# Altium schematic sheet watch.SchDoc
size A3
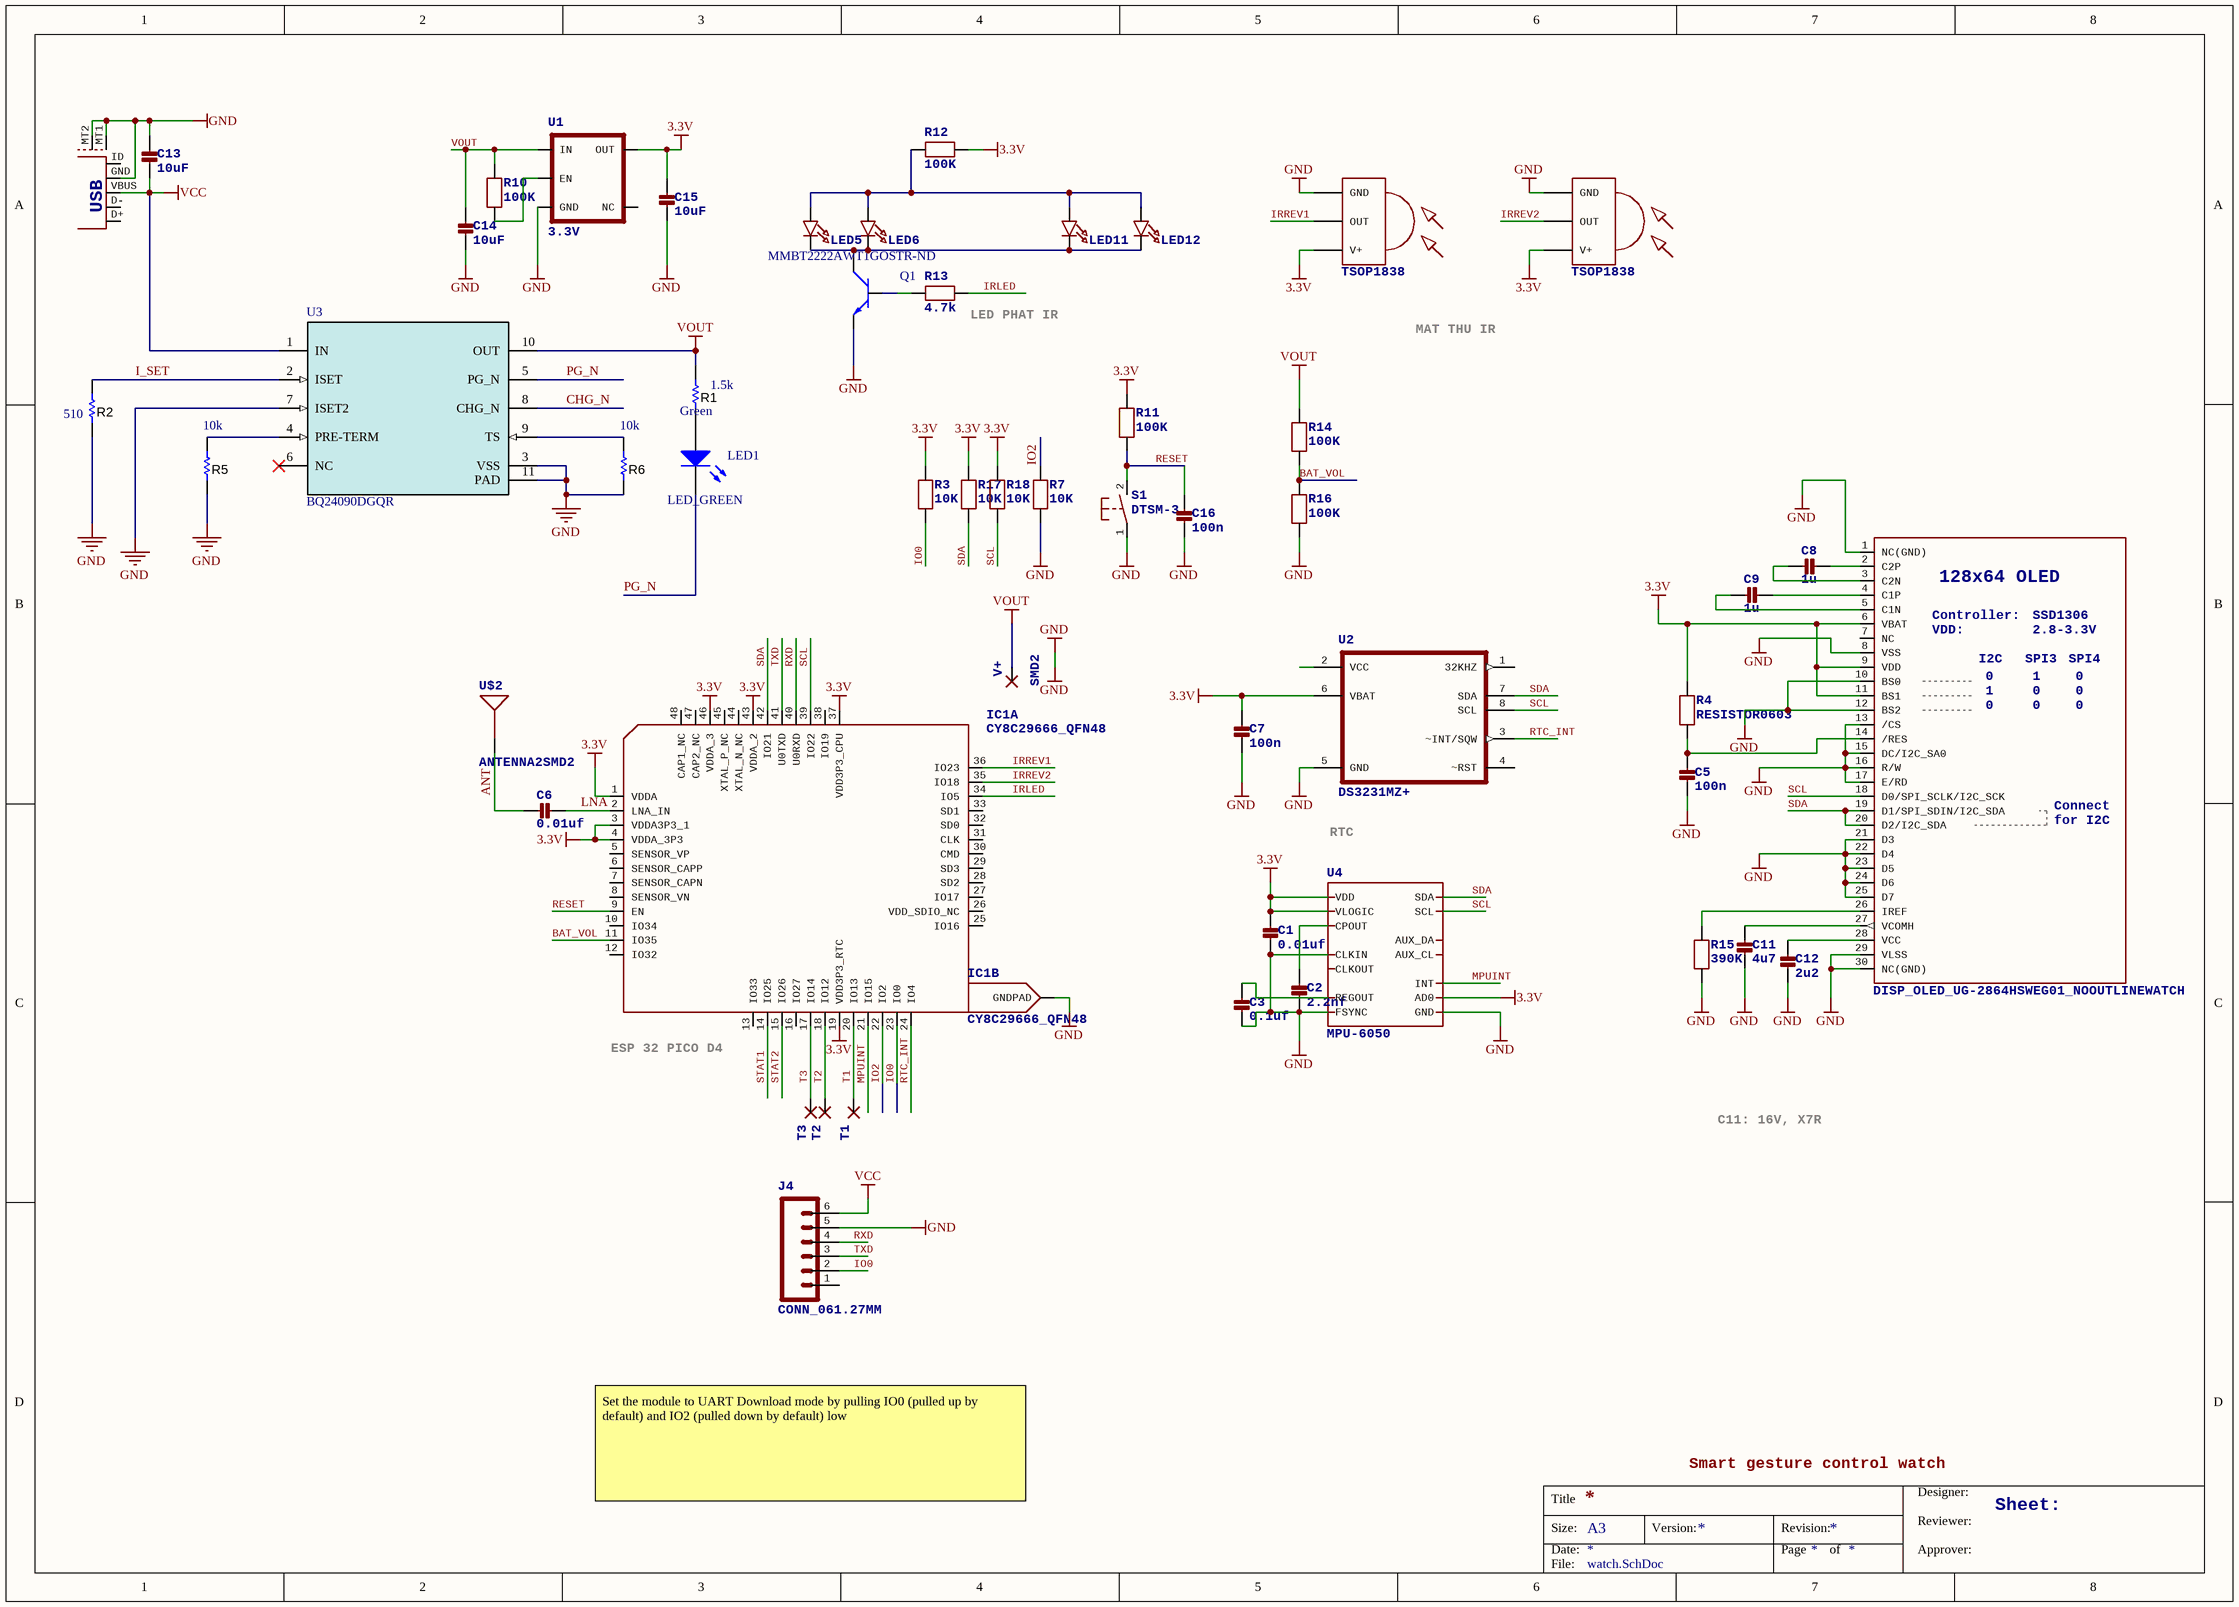
[diagram p0: watch.SchDoc]

## Parts
C1  0.01uf  [0603]
C2  2.2nf  [0603]
C3  0.1uf  [0603]
C5  100n  [0603]
C6  0.01uf  [0603]
C7  100n  [0603]
C8  1u  [0603]
C9  1u  [0603]
C11  4u7  [0603]
C12  2u2  [0603]
C13  10uF  [0603]
C14  10uF  [0603]
C15  10uF  [0603]
C16  100n  [0603]
IC1  CY8C29666_QFN48  [QFN48]  (parts A,B of 2)
J4  CONN_061.27MM  [1X06_1.27MM]
LED1  LED_GREEN  Color: Green  [led0603]
LED5  LED0805  [CHIPLED_0805]  (value not drawn)
LED6  LED0805  [CHIPLED_0805]  (value not drawn)
LED11  LED0805  [CHIPLED_0805]  (value not drawn)
LED12  LED0805  [CHIPLED_0805]  (value not drawn)
OLED1  DISP_OLED_UG-2864HSWEG01_NOOUTLINEWATCH  128x64OLED: 128x64 OLED  forI2C: for I2C  Controller: Controller:  VDD: VDD:  [UG-2864HSWEG01_1.3_WRAPAROUND_WATCH]
Q1  Supplier Part Number 1: MMBT2222AWT1GOSTR-ND  [SOT-323]  (hidden comment: MMBT2222A)
R1  Resistance (Ohms): 1.5k  [0603]
R2  Resistance (Ohms): 510  [0603]
R3  10K  [0603]
R4  RESISTOR0603  [0603]
R5  Resistance (Ohms): 10k  [0603]
R6  Resistance (Ohms): 10k  [0603]
R7  10K  [0603]
R10  100K  [0603]
R11  100K  [0603]
R12  100K  [0603]
R13  4.7k  [0603]
R14  100K  [0603]
R15  390K  [0603]
R16  100K  [0603]
R17  10K  [0603]
R18  10K  [0603]
S1  DTSM-3  [DTSM-3]
T1  SMD2  [SMD1,27-2,54]  (value not drawn)
T2  SMD2  [SMD1,27-2,54]  (value not drawn)
T3  SMD2  [SMD1,27-2,54]  (value not drawn)
U1  3.3V  [SOT23-5]
U2  DS3231MZ+  [SOIC8_150MIL_SMPAD]
U3  BQ24090DGQR  [DGQ0010D_NV_N]
U4  MPU-6050  [QFN.24.4X4]
U$2  ANTENNA2SMD2  [ANTENNA-CHIP3]
U$3  TSOP1838  [TSOP18XX]
U$4  TSOP1838  [TSOP18XX]
USB1  USB-MICROBLARGEPAD  [USB-MICROB_LARGEPAD]  (value not drawn)
V+  SMD2  [SMD1,27-2,54]

## Nets
3.3V: C1.2(P$2) C7.1(P$1) C15.1(P$1) IC1.1(VDDA) IC1.3(VDDA3P3_1) IC1.4(VDDA_3P3) IC1.19(VDD3P3_RTC) IC1.37(VDD3P3_CPU) IC1.43(VDDA_2) IC1.46(VDDA_3) OLED1.6(VBAT) OLED1.9(VDD) OLED1.11(BS1) R3.1 R4.2 R11.2 R12.1 R17.1 R18.1 U1.5(OUT) U2.6(VBAT) U4.8(VLOGIC) U4.9(AD0) U4.13(VDD) U$3.VCC(V+) U$4.VCC(V+)
GND: C1.1(P$1) C2.2(P$2) C3.1(P$1) C5.2(P$2) C7.2(P$2) C11.2(P$2) C12.2(P$2) C13.1(P$1) C14.2(P$2) C15.2(P$2) C16.2(P$2) IC1.EXP(GNDPAD) J4.5 OLED1.1(NC(GND)) OLED1.8(VSS) OLED1.10(BS0) OLED1.12(BS2) OLED1.13(/CS) OLED1.15(DC/I2C_SA0) OLED1.16(R/W) OLED1.17(E/RD) OLED1.21(D3) OLED1.22(D4) OLED1.23(D5) OLED1.24(D6) OLED1.25(D7) OLED1.29(VLSS) OLED1.30(NC(GND)) Q1.2(E) R2.1 R5.1 R6.1 R7.2 R15.1 R16.2 S1.1 U1.2(GND) U2.5(GND) U3.3(VSS) U3.7(ISET2) U3.11(PAD) U4.1(CLKIN) U4.11(FSYNC) U4.18(GND) U$3.GND U$4.GND USB1.GND USB1.MT1(SHEILD1) USB1.MT2(SHEILD2)
VCC: C13.2(P$2) J4.6 U3.1(IN) USB1.VBUS
VOUT: C14.1(P$1) R1.2 R10.2 R14.1 U1.1(IN) U3.10(OUT) V+.1(P)
ANT: C6.1(P$1) U$2.FEED(SIGNAL)
BAT_VOL: IC1.11(IO35) R14.2 R16.1
CHG_N: U3.8(CHG_N)
I_SET: R2.2 U3.2(ISET)
IO0: IC1.23(IO0) J4.2 R3.2
IO2: IC1.22(IO2) R7.1
IRLED: IC1.34(IO5) R13.1
IRREV1: IC1.36(IO23) U$4.OUT
IRREV2: IC1.35(IO18) U$3.OUT
LNA: C6.2(P$2) IC1.2(LNA_IN)
MPUINT: IC1.21(IO15) U4.12(INT)
PG_N: LED1.2(K) U3.5(PG_N)
RESET: C16.1(P$1) IC1.9(EN) R11.1 S1.2
RTC_INT: IC1.24(IO4) U2.3(~INT/SQW)
RXD: IC1.40(U0RXD) J4.4
SCL: IC1.39(IO22) OLED1.18(D0/SPI_SCLK/I2C_SCK) R18.2 U2.8(SCL) U4.23(SCL)
SDA: IC1.42(IO21) OLED1.19(D1/SPI_SDIN/I2C_SDA) OLED1.20(D2/I2C_SDA) R17.2 U2.7(SDA) U4.24(SDA)
STAT1: IC1.14(IO25)
STAT2: IC1.15(IO26)
T1: IC1.20(IO13) T1.1(P)
T2: IC1.18(IO12) T2.1(P)
T3: IC1.17(IO14) T3.1(P)
TXD: IC1.41(U0TXD) J4.3
NetC2_1: C2.1(P$1) U4.20(CPOUT)
NetC3_2: C3.2(P$2) U4.10(REGOUT)
NetC5_1: C5.1(P$1) OLED1.14(/RES) R4.1
NetC8_1: C8.1(P$1) OLED1.3(C2N)
NetC8_2: C8.2(P$2) OLED1.2(C2P)
NetC9_1: C9.1(P$1) OLED1.5(C1N)
NetC9_2: C9.2(P$2) OLED1.4(C1P)
NetC11_1: C11.1(P$1) OLED1.27(VCOMH)
NetC12_1: C12.1(P$1) OLED1.28(VCC)
NetLED1_1: LED1.1(A) R1.1
NetLED5_1: LED5.1(A) LED6.1(A) LED11.1(A) LED12.1(A) R12.2
NetLED5_2: LED5.2(C) LED6.2(C) LED11.2(C) LED12.2(C) Q1.3(C)
NetOLED1_26: OLED1.26(IREF) R15.2
NetQ1_1: Q1.1(B) R13.2
NetR5_2: R5.2 U3.4(PRE-TERM)
NetR6_2: R6.2 U3.9(TS)
NetR10_1: R10.1 U1.3(EN)

Not connected (* = marked no-connect by the designer): IC1 5(SENSOR_VP) 6(SENSOR_CAPP) 7(SENSOR_CAPN) 8(SENSOR_VN) 10(IO34) 12(IO32) 13(IO33) 16(IO27) 25(IO16) 26(VDD_SDIO_NC) 27(IO17) 28(SD2) 29(SD3) 30(CMD) 31(CLK) 32(SD0) 33(SD1) 38(IO19) 44(XTAL_N_NC) 45(XTAL_P_NC) 47(CAP2_NC) 48(CAP1_NC); J4 1; OLED1 7(NC); U1 4(NC); U2 1(32KHZ) 2(VCC) 4(~RST); U3 6(NC)*; U4 6(AUX_DA) 7(AUX_CL) 22(CLKOUT); USB1 D+ D- ID

## Notes on the sheet
- (near R13) LED PHAT IR
- MAT THU IR
- RTC
- (near IC1) ESP 32 PICO D4
- C11: 16V, X7R
- Smart gesture control watch
- Set the module to UART Download mode by pulling IO0 (pulled up by default) and IO2 (pulled down by default) low
- Sheet:
- Title
- Size:
- Date:
- A3
- Version:
- Revision:
- Page
- of
- Designer:
- Reviewer:
- Approver:
- File:

## Library data of the parts
C1-C3 C5-C9 C11-C16 = CAP_CERAMIC0603: Ceramic Capacitors0402 - 0402 Surface Mount Capacitors  16pF 50V 5% [Digikey: 445-4899-2-ND]  18pF 50V 5% [Digikey: 490-1281-2-ND]  22pF 50V 5% [Digikey: 490-1283-2-ND]  68pF 50V 5% [Digikey: 490-1289-2-ND]  0.1uF 10V 10% [Digikey: 490-1318-2-ND]  1.0uF 6.3V 10% [Digikey: 490-1320-2-ND]    0603 - 0603 Surface Mount Capacitors  16 pF 50V 5% [Digikey: 445-5051-2-ND]  22 pF 50V [Digikey: PCC220ACVTR-ND]  33 pF 50V 5% [Digikey: 490-1415-1-ND]  56pF 50V 5% [Digikey: 490-1421-1-ND]  220pF 50V 5% [Digikey: 445-1285-1-ND]  680 pF 50V   2200 pF 50V 5% C0G [Digikey: 445-1297-1-ND]  5600 pF 100V 5% X7R [Digikey: 478-3711-1-ND]  0.1 µF 25V 10% [Digikey: PCC2277TR-ND]  0.22 µF 16V 10% X7R [Digikey: 445-1318-1-ND]  1.0 µF 25V 10% [Digikey: 445-5146-2-ND]    0603 - RF Specific  3pF 250V +/-0.1pF RF [Digikey: 712-1347-1-ND]  18 pF 250V 5%  [Digikey: 478-3505-1-ND or 712-1322-1-ND]  56 pF 250V 5% C0G RF [Digikey: 490-4867-1-ND]  68 pF 250V RF [Digikey: 490-4868-1-ND]    0805 - 0805 Surface Mount Capacitors  220 pF 250V 2% RF Ceramic Capacitor [Digikey: 712-1398-1-ND]  1000 pF 50V 2% NP0 Ceramic Capacitor [Digikey: 478-3760-1-ND]  0.1 µF 25V 10% Ceramic Capacitor [Digikey: PCC1828TR-ND]  1.0 µF 16V 10% Ceramic Capacitor[Digikey: 490-1691-2-ND]  10.0 µF 10V 10% Ceramic Capacitor[Digikey: 709-1228-1-ND]  10.0 uF 16V 10% Ceramic Capacitor [Digikey: 478-5165-2-ND]  47 uF 6.3V 20% Ceramic Capacitor [Digikey: 587-1779-1-ND or 399-5506-1-ND]       1206 - 1206 Surface Mount Capacitors  47uF 10V 20% Ceramic Capacitor [Digikey: 490-5528-1-ND or 399-5508-1-ND or 445-6010-1-ND]  100uF 6.3V -20%, +80% Y5V Ceramic Capacitor (Digikey: 490-4512-1-ND, Mouser: 81-GRM31CF50J107ZE1L)
J4 = CONN_061.27MM: Multi connection point. Often used as Generic Header-pin footprint for 0.1 inch spaced/style header connections    On any of the 0.1 inch spaced packages, you can populate with these:  Break Away Headers - Straight (PRT-00116)   Break Away Male Headers - Right Angle (PRT-00553)   Female Headers (PRT-00115)   Break Away Headers - Machine Pin (PRT-00117)   Break Away Female Headers - Swiss Machine Pin (PRT-00743)   Arduino Stackable Header - 6 Pin (PRT-09280)        For SCREWTERMINALS and SPRING TERMINALS visit here:  Screw Terimnals on SparkFun.com (5mm/3.5mm/2.54mm spacing)       This device is also useful as a general connection point to wire up your design to another part of your project. Our various solder wires solder well into these plated through hole pads.  Hook-Up Wire - Assortment (Stranded, 22 AWG) (PRT-11375)   Hook-Up Wire - Assortment (Solid Core, 22 AWG) (PRT-11367)   View the entire wire category on our website here
LED1 = LED_GREEN: Typical INFRARED GaAs LED; Manufacturer: Lite-On Inc.; Manufacturer Part Number: LTST-C191KGKT; Lens Color: Colorless; Lens Transparency: Clear; Millicandela Rating: 35mcd; Lens Style/Size: Rectangle with Flat Top, 1.10mm x 0.80mm; Voltage - Forward (Vf) (Typ): 2V; Current - Test: 20mA; Viewing Angle: 130°; Wavelength - Dominant: 571nm; Wavelength - Peak: 574nm; Supplier 1: Digi-Key; RoHS: RoHS Compliant; Category: Optoelectronics; Stock 1: 780000; Pricing 1: 5000=0.0404, 10000=0.03636, 25000=0.03232, 50000=0.02929, 125000=0.02727 (USD); Packaging: Tape & Reel (TR); Part Status: Active; Mounting Type: Surface Mount; Features: -; Package / Case: 0603 (1608 Metric); Supplier Device Package: *; Size / Dimension: 1.60mm L x 0.80mm W; Height (Max): 0.55mm; ComponentLink1URL: http://optoelectronics.liteon.com/upload/download/DS22-2000-228/S_110_LTST-C191KGKT.pdf; ComponentLink1Description: http://optoelectronics.liteon.com/upload/download/DS22-2000-228/S_110_LTST-C191KGKT.pdf; Supplier Part Number 1: 160-1446-2-ND
LED5 LED6 LED11 LED12 = LED0805: LED0603 - 0603 Surface Mount Package    2mA: Green LED - Low Power (3.9mcd, 2ma, 1.7Vf) - Digikey: 475-2709-2-ND  Orange LED - Low Power (9.8mcd, 2ma, 1.8Vf) - Digikey: 475-1194-2-ND  Red LED - Low Power (5mcd, 2ma, 1.8Vf) - Digikey: 475-1195-2-ND  Yellow LED - Low Power (7mcd, 2ma, 1.8Vf) - Digikey: 475-1196-2-ND       5mA: Blue LED - Low Power (17mcd, 5ma, 2.9Vf) - Digikey: LNJ937W8CRACT-ND    0805 - 0805 Surface Mount Package    2mA: Red LED (8.8mcd, 2mA, 1.8Vf, Clear) - Low Power [Digikey: 475-2510-1-ND]  Green LED (5mcd, 2mA, 1.8Vf, Clear) - Low Power [Digikey: 475-2730-1-ND]  Yellow LED (11.3mcd, 2mA, 1.8Vf, Clear) - Low Power [Digikey: 475-2555-1-ND]       20mA: Red LED (104mcd, 20mA, Diffused) - LS R976 [Digikey: 475-1278-6-ND]  Red LED (12mcd, 20mA, 2.0Vf, Clear) - APT2012EC [Digikey: 754-1128-1-ND]  Green LED (15mcd, 20mA, 2.2Vf, Clear) - APT2012GC [Digikey: 754-1131-1-ND]  Orange LED (160mcd, 20mA, 2.1Vf, Clear) - APT2012SECK [Digikey: 754-1130-1-ND]     1206 - 1206 Surface Mount Package  Green LED (26mcd, 20mA, Diffused) - LG N971  [Digikey: 475-1407-6-ND]  Red LED (15mcd, 20mA, Diffused) - LH N974 [Digikey: 475-1416-6-ND]
Q1 = MMBT2222A: NPN switching transistor  40V 600mA SOT23; Manufacturer: ON Semiconductor; Manufacturer Part Number: MMBT2222AWT1G; Vce Saturation (Max) @ Ib, Ic: 1V @ 50mA, 500mA; DC Current Gain (hFE) (Min) @ Ic, Vce: 100 @ 150mA, 10V; Frequency - Transition: 300MHz; Supplier 1: Digi-Key; RoHS: RoHS Compliant; Category: Discrete Semiconductor Products; Stock 1: 36000; Pricing 1: 3000=0.02383, 6000=0.02149, 15000=0.01869, 30000=0.01682, 75000=0.01495, 150000=0.01246 (USD); Packaging: Tape & Reel (TR); Part Status: Active; Transistor Type: NPN; Current - Collector Cutoff (Max): -; Operating Temperature: -55°C ~ 150°C (TJ); Mounting Type: Surface Mount; Package / Case: SC-70, SOT-323; Supplier Device Package: SC-70-3 (SOT323); Base Part Number: MMBT2222A; ComponentLink1URL: http://www.onsemi.com/pub/Collateral/MMBT2222AWT1-D.PDF; ComponentLink1Description: http://www.onsemi.com/pub/Collateral/MMBT2222AWT1-D.PDF
R1 = RC0603JR-071K5L: RES SMD 1.5K OHM 5% 1/10W 0603; Manufacturer: Yageo; Power (Watts): 0.1W, 1/10W; Temperature Coefficient: ±100ppm/°C; Supplier 1: Digi-Key; Manufacturer Part Number: RC0603JR-071K5L; RoHS: RoHS Compliant; Category: Resistors; Stock 1: 405000; Pricing 1: 5000=0.00129, 10000=0.00112, 25000=0.00099, 50000=0.0009, 125000=0.00089 (USD); Packaging: Tape & Reel (TR); Part Status: Active; Tolerance: ±5%; Composition: Thick Film; Features: Moisture Resistant; Operating Temperature: -55°C ~ 155°C; Package / Case: 0603 (1608 Metric); Supplier Device Package: 0603; Size / Dimension: 0.063" L x 0.031" W (1.60mm x 0.80mm); Height: 0.022" (0.55mm); Number of Terminations: 2; Failure Rate: -; ComponentLink1URL: http://www.yageo.com/documents/recent/PYu-RC_Group_51_RoHS_L_04.pdf; ComponentLink1Description: http://www.yageo.com/documents/recent/PYu-RC_Group_51_RoHS_L_04.pdf; Supplier Part Number 1: 311-1.5KGRTR-ND
R2 = RC0603JR-07510RL: RES SMD 510 OHM 5% 1/10W 0603; Manufacturer: Yageo; Power (Watts): 0.1W, 1/10W; Temperature Coefficient: ±100ppm/°C; Supplier 1: Digi-Key; Manufacturer Part Number: RC0603JR-07510RL; RoHS: RoHS Compliant; Category: Resistors; Stock 1: 795000; Pricing 1: 5000=0.00129, 10000=0.00112, 25000=0.00099, 50000=0.0009, 125000=0.00089 (USD); Packaging: Tape & Reel (TR); Part Status: Active; Tolerance: ±5%; Composition: Thick Film; Features: Moisture Resistant; Operating Temperature: -55°C ~ 155°C; Package / Case: 0603 (1608 Metric); Supplier Device Package: 0603; Size / Dimension: 0.063" L x 0.031" W (1.60mm x 0.80mm); Height: 0.022" (0.55mm); Number of Terminations: 2; Failure Rate: -; ComponentLink1URL: http://www.yageo.com/documents/recent/PYu-RC_Group_51_RoHS_L_04.pdf; ComponentLink1Description: http://www.yageo.com/documents/recent/PYu-RC_Group_51_RoHS_L_04.pdf; Supplier Part Number 1: 311-510GRTR-ND
R3 R4 R7 R10-R18 = RESISTOR0603: Resistors0402 - 0402 Surface Mount Package  22 Ohm 1% 1/16W [Digikey: 311-22.0LRTR-ND]  33 Ohm 5% 1/16W  1.0K 5% 1/16W  1.5K 5% 1/16W  2.0K 1% 1/16W  10.0K 1% 1/16W [Digikey: 311-10.0KLRTR-ND]  10.0K 5% 1/16W [Digikey: RMCF0402JT10K0TR-ND]  12.1K 1% 1/16W [Digikey: 311-22.0LRTR-ND]  100.0K 5% 1/16W    0603 - 0603 Surface Mount Package  0 Ohm 1/10 Watt 1% Resistor  15 Ohm 1/10 Watt 1% Resistor  33 Ohm 1/10 Watt 1% Resistor  49.9 Ohm 1/10 Watt 1% Resistor  100 Ohm 1/10 Watt 1% Resistor  150 Ohm 1/10 Watt 1% Resistor  240 Ohm 1/10 Watt 1% Resistor  390 Ohm 1/10 Watt 1% Resistor  560 Ohm 1/10 Watt 1% Resistor  680 Ohm 1/10 Watt 1% Resistor  750 Ohm 1/10 Watt 1% Resistor  1.0K Ohm 1/10 Watt 1% Resistor  1.5K Ohm 1/10 Watt 1% Resistor  2.0K Ohm 1/10 Watt 1% Resistor  2.2K Ohm 1/10 Watt 1% Resistor  3.3K Ohm 1/10 Watt 1% Resistor  4.7K Ohm 1/10 Watt 1% Resistor  10.0K Ohm 1/10 Watt 1% Resistor  12.0K Ohm 1/10 Watt 1% Resistor  12.1K Ohm 1/10 Watt 1% Resistor  20.0K Ohm 1/10 Watt 1% Resistor  33.0K Ohm 1/10 Watt 1% Resistor  100.0K Ohm 1/10 Watt 1% Resistor    0805 - 0805 Surface Mount Package  0 Ohm 1/8 Watt 1% Resistor  33 Ohm 1/8 Watt 1% Resistor  100 Ohm 1/8 Watt 1% Resistor  150 Ohm 1/8 Watt 1% Resistor  200 Ohm 1/8 Watt 1% Resistor  240 Ohm 1/8 Watt 1% Resistor  330 Ohm 1/8 Watt 1% Resistor  390 Ohm 1/8 Watt 1% Resistor  470 Ohm 1/8 Watt 1% Resistor  1.0K Ohm 1/8 Watt 1% Resistor  1.5K Ohm 1/8 Watt 1% Resistor  2.0K Ohm 1/8 Watt 1% Resistor  4.7K Ohm 1/8 Watt 1% Resistor  5.1K Ohm 1/8 Watt 1% Resistor  5.6K Ohm 1/8 Watt 1% Resistor  10.0K Ohm 1/8 Watt 1% Resistor  22.0K Ohm 1/8 Watt 1% Resistor  33.0K Ohm 1/8 Watt 1% Resistor  100K Ohm 1/8 Watt 1% Resistor    1206 - 1206 Surface Mount Package  2012 - 2010 Surface Mount Package  0.11 Ohm 1/2 Watt 1% Resistor - Digikey: RHM.11UCT-ND
R5 R6 = RC0603JR-0710KL: RES SMD 10K OHM 5% 1/10W 0603; Manufacturer: Yageo; Power (Watts): 0.1W, 1/10W; Temperature Coefficient: ±100ppm/°C; Supplier 1: Digi-Key; Manufacturer Part Number: RC0603JR-0710KL; RoHS: RoHS Compliant; Category: Resistors; Stock 1: 5085000; Pricing 1: 5000=0.00129, 10000=0.00112, 25000=0.00099, 50000=0.0009, 125000=0.00089 (USD); Packaging: Tape & Reel (TR); Part Status: Active; Tolerance: ±5%; Composition: Thick Film; Features: Moisture Resistant; Operating Temperature: -55°C ~ 155°C; Package / Case: 0603 (1608 Metric); Supplier Device Package: 0603; Size / Dimension: 0.063" L x 0.031" W (1.60mm x 0.80mm); Height: 0.022" (0.55mm); Number of Terminations: 2; Failure Rate: -; ComponentLink1URL: http://www.yageo.com/documents/recent/PYu-RC_Group_51_RoHS_L_04.pdf; ComponentLink1Description: http://www.yageo.com/documents/recent/PYu-RC_Group_51_RoHS_L_04.pdf; Supplier Part Number 1: 311-10KGRTR-ND
T1-T3 V+ = SMD2: SMD PAD
U1 = V_REG_AP2112K-3.3V: AP2112 - 600mA CMOS LDO Regulator w/ Enable    The AP2112 is CMOS process low dropout linear regulator with enable function, the regulator delivers a guaranteed 600mA (min.) continuous load current.   Features  Output Voltage Accuracy: ±1.5%   Output Current: 600mA (Min.)   Foldback Short Current Protection: 50mA   Enable Function to Turn ON/OFF VOUT  Low Dropout Voltage (3.3V): 250mV (Typ.) @IOUT=600mA   Excellent Load Regulation: 0.2%/A (Typ.)   Excellent Line Regulation: 0.02%/V (Typ.)   Low Quiescent Current: 55μA (Typ.)  Low Standby Current: 0.01μA (Typ.)  Low Output Noise: 50μVRMS   PSRR: 100Hz -65dB, 1kHz -65dB    OTSD Protection   Stable  with  1.0μF Flexible Cap: Ceramic, Tantalum and Aluminum Electrolytic   Operation Temperature Range: -40°C to 85°C   ESD: MM 400V, HBM 4000V; PROD_ID: VREG-12457; VALUE: 3.3V
U2 = DS3231MZ+SMPAD
U3 = BQ24090DGQR: Single Cell Li-Ion and Li-Pol Battery Charger; Manufacturer: Texas Instruments; Battery Chemistry: Lithium-Ion/Polymer; Number of Cells: 1; Current - Charging: Constant - Programmable; Programmable Features: Current; Fault Protection: Over Temperature, Over Voltage, Short Circuit; Charge Current - Max: 1A; Battery Pack Voltage: 4.2V; Voltage - Supply (Max): 6.45V; Interface: USB; Application_BuildNumber: *; Supplier 1: Digi-Key; Manufacturer Part Number: BQ24090DGQR; RoHS: RoHS Compliant; Category: Integrated Circuits (ICs); Stock 1: 0; Pricing 1: 2500=0.45 (USD); Packaging: Tape & Reel (TR); Part Status: Active; Operating Temperature: 0°C ~ 125°C (TJ); Package / Case: 10-TFSOP, 10-MSOP (0.118", 3.00mm Width) Exposed Pad; Supplier Device Package: 10-MSOP-PowerPad; ComponentLink1URL: http://www.ti.com/lit/ds/symlink/bq24092.pdf; ComponentLink1Description: http://www.ti.com/lit/ds/symlink/bq24092.pdf; Supplier Part Number 1: 296-38875-2-ND
U$2 = ANTENNA2SMD2: Chip antenna   Single endded antenna. Common with smaller chip antennas. CHIP4 package is the GPS Chip Antenna SKU: GPS-08418. CHIP5 package is 2.4GHz chip antenna SKU: WRL-00144.
U$3 U$4 = TSOP1838: IR Receiver and Demodulator
OLED1 = DISP_OLED_UG-2864HSWEG01_NOOUTLINEWATCH: I2C: I2C; SPI3: SPI3; 0: 0; 1: 1; Connect: Connect; SSD1306: SSD1306; 2.8-3.3V: 2.8-3.3V; SPI4: SPI4
USB1 = USB-MICROBLARGEPAD: USB: USB